# EAGLE design Haar_HardMount (EAGLE 9.6.2)
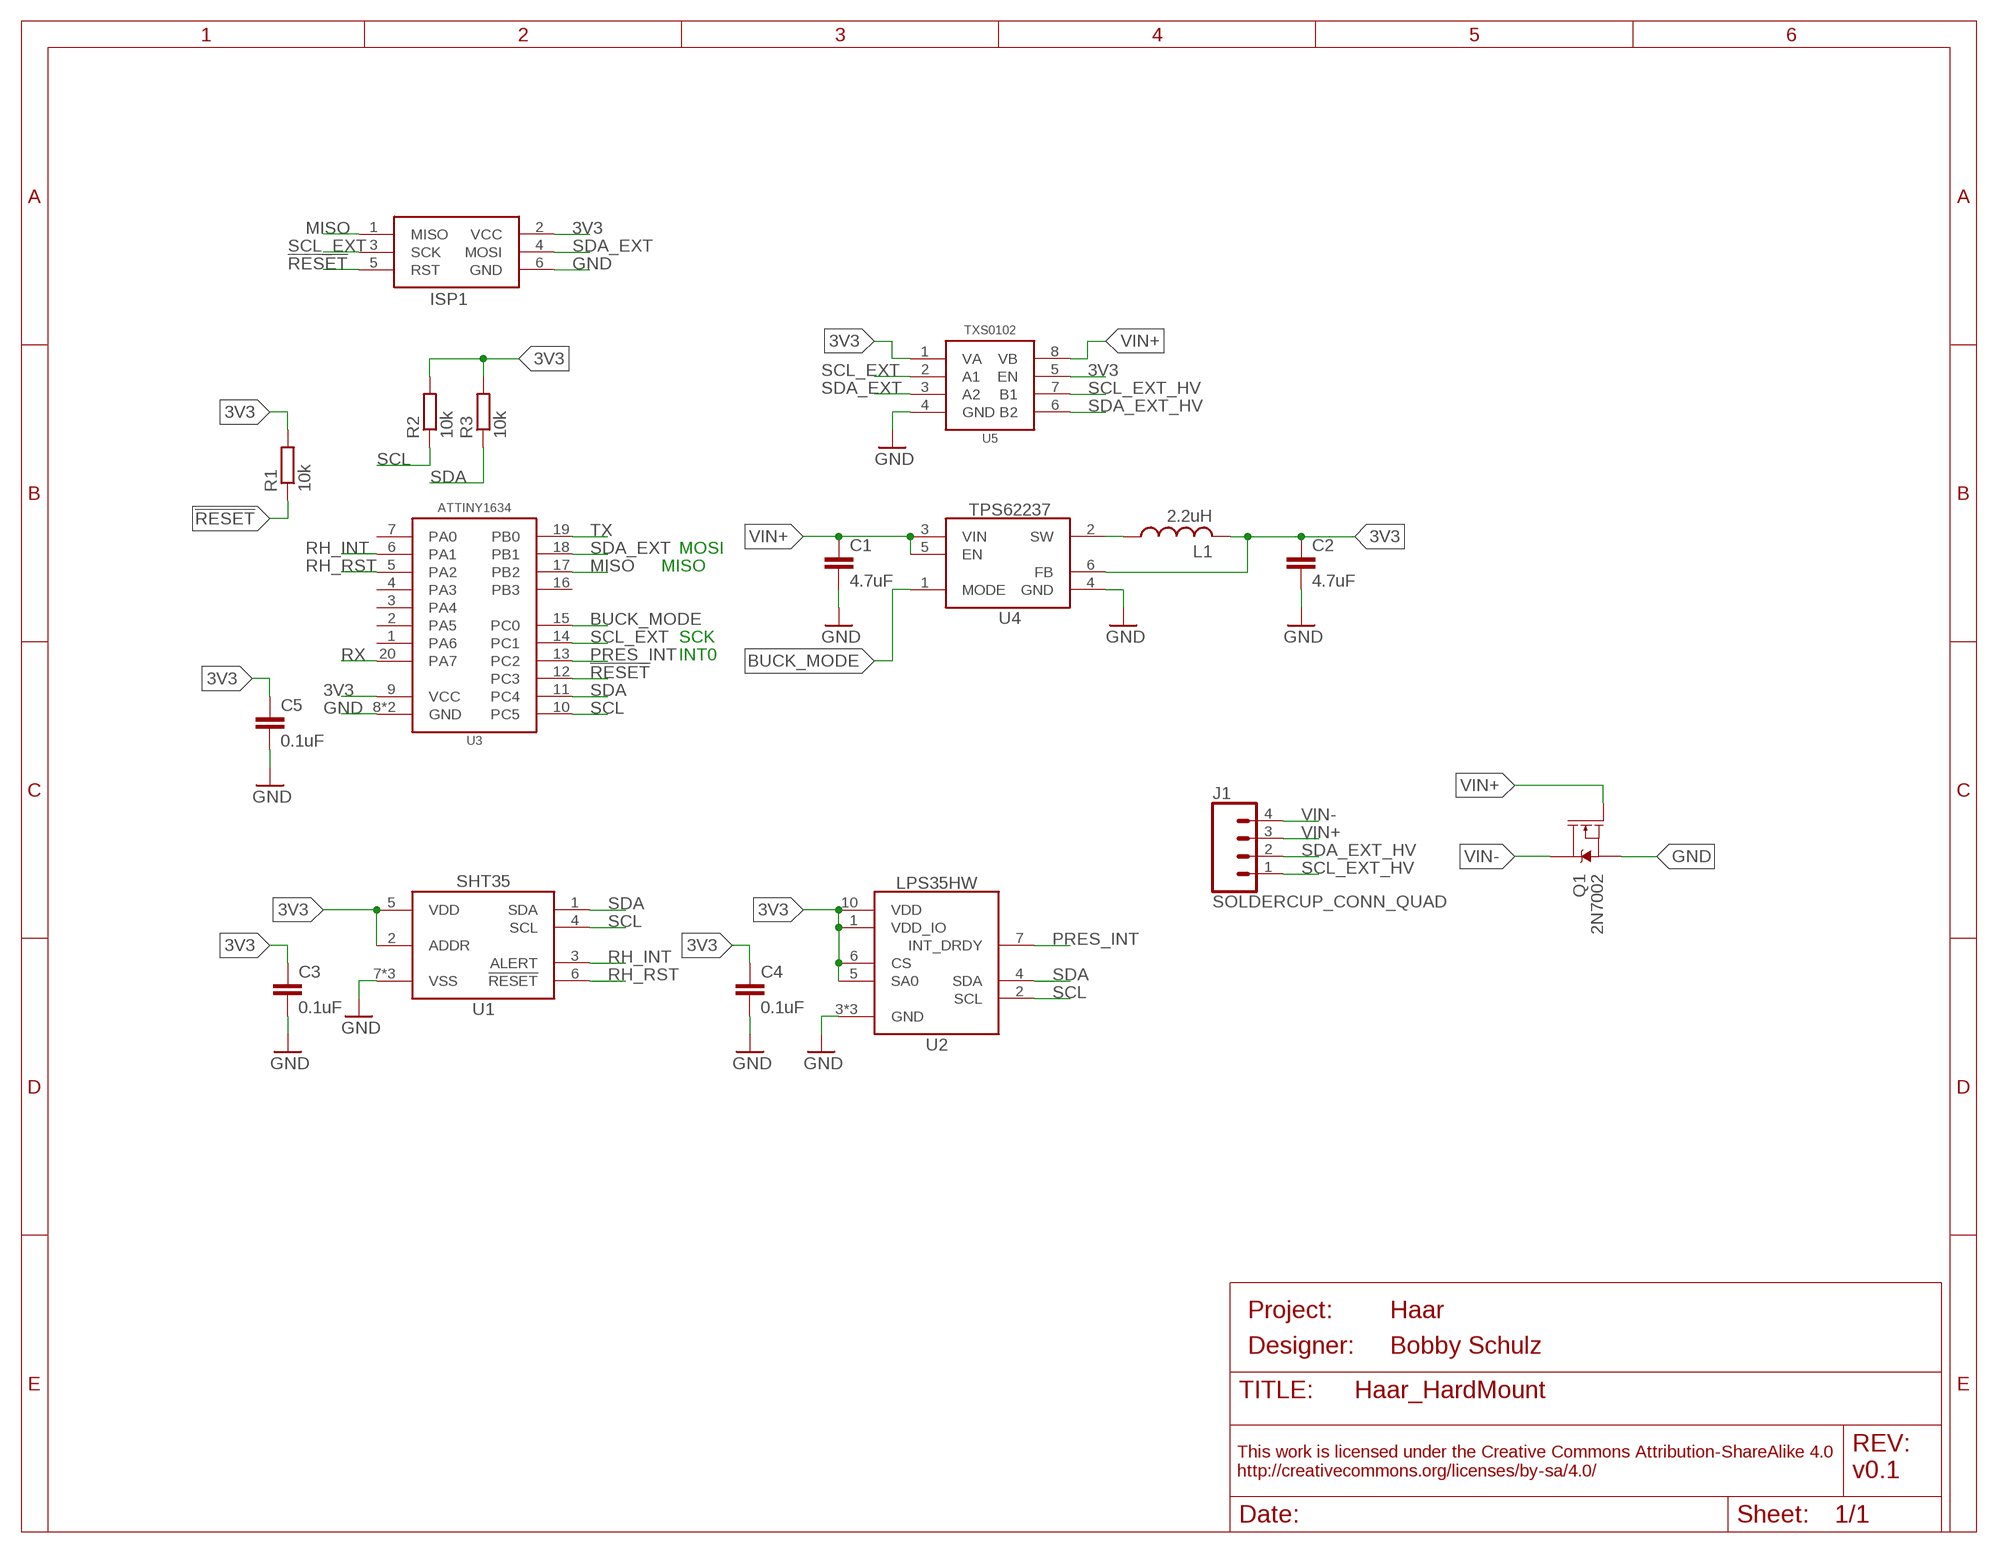
[diagram p0: schematic, sheet 1]
FRAME1 (FRAME_A_L): DESIGNER: Bobby Schulz; PROJECT: Haar; REV: v0.1

## Parts
C1  4.7uF  C-EUC0402  [C0402]
C2  4.7uF  C-EUC0402  [C0402]
C3  0.1uF  C-EU0.1UFC0402  [C0402]
C4  0.1uF  C-EU0.1UFC0402  [C0402]
C5  0.1uF  C-EU0.1UFC0402  [C0402]
ISP1  AVRISP1.27MM  [2X3_1.27]
J1  SOLDERCUP_CONN_QUAD  [SOLDERCUP_CONN_QUAD]
L1  2.2uH  INDUCTOR0805  [0805]
Q1  2N7002  MOSFET-NCH-2N7002PW  [SOT323]
R1  10k  R-EU_10KR0402  [R0402]
R2  10k  R-EU_10KR0402  [R0402]
R3  10k  R-EU_10KR0402  [R0402]
U1  SHT35DFN  [DFN_8_2.5X2.5]
U2  LPS35HW  [CCLGA10L]
U3  ATTINY1634QFN  [QFN20]
U4  TPS62237DRY  [DRY0006A]
U5  TXS0102DQM  [DQM_R-PX2SON-N8]

## Nets
3V3: C2.1 C3.1 C4.1 C5.1 ISP1.2(VCC) L1.2 R1.2 R2.2 R3.2 U1.2(ADDR) U1.5(VDD) U2.1(VDD_IO) U2.5(SA0) U2.6(CS) U2.10(VDD) U3.9(VCC) U4.6(FB) U5.1(VA) U5.5(EN)
!RESET: ISP1.5(RST) R1.1 U3.12(PC3)
BUCK_MODE: U3.15(PC0) U4.1(MODE)
GND: C1.2 C2.2 C3.2 C4.2 C5.2 ISP1.6(GND) Q1.2(S) U1.7(VSS) U1.8(VSS) U1.EP(VSS) U2.3(GND) U2.8(GND) U2.9(GND) U3.8(GND) U3.EP(GND) U4.4(GND) U5.4(GND)
MISO: ISP1.1(MISO) U3.17(PB2)
N$1: L1.1 U4.2(SW)
PRES_INT: U2.7(INT_DRDY) U3.13(PC2)
RH_INT: U1.3(ALERT) U3.6(PA1)
RH_RST: U1.6(!RESET) U3.5(PA2)
RX: U3.20(PA7)
SCL: R2.1 U1.4(SCL) U2.2(SCL) U3.10(PC5)
SCL_EXT: ISP1.3(SCK) U3.14(PC1) U5.2(A1)
SCL_EXT_HV: J1.1 U5.7(B1)
SDA: R3.1 U1.1(SDA) U2.4(SDA) U3.11(PC4)
SDA_EXT: ISP1.4(MOSI) U3.18(PB1) U5.3(A2)
SDA_EXT_HV: J1.2 U5.6(B2)
TX: U3.19(PB0)
VIN+: C1.1 J1.3 Q1.1(G) U4.3(VIN) U4.5(EN) U5.8(VB)
VIN-: J1.4 Q1.3(D)
Unconnected: U3.1(PA6) U3.2(PA5) U3.3(PA4) U3.4(PA3) U3.7(PA0) U3.16(PB3)

## Notes on the sheet
- MOSI
- MISO
- SCK
- INT0

## Library data of the parts
C1 C2 = bschulz_passives:C-EU: CAPACITOR, European symbol; DIGIKEY: 490-14306-1-ND; MF: Murata; MPN: GRM155R61A475MEAAD
C3-C5 = bschulz_passives:C-EU: CAPACITOR, European symbol; DIGIKEY: 490-4759-1-ND; MF: Murata; MPN: GCM155R71C104KA55D
ISP1 = bschulz:AVRISP: AVR ISP HEADER Standard 6 pin header for AVR programming
J1 = bschulz:SOLDERCUP_CONN_QUAD
L1 = bschulz:INDUCTOR: Genaric inductor; DIGIKEY: 732-2953-1-ND; MF: Wurth; MPN: 74479775222
Q1 = bschulz:MOSFET-NCH: N-channel MOSFETs Voltage controlled devices that allow control of high current outputs. SparkFun Products: SparkFun OpenScale <https://www.sparkfun.com/products/13261> SparkFun Digital Sandbox <https://www.sparkfun.com/products/12651> SparkFun Monster Moto Shield <https://www.sparkfun.com/products/10182> SparkFun MOSFET Power Controller <https://www.sparkfun.com/products/11214>; DIGIKEY: 2N7002W-FDICT-ND; MF: Diodes Incorporated; MPN: 2N7002W-7-F; PROD_ID: TRANS-11151
R1-R3 = bschulz_passives:R-EU_: RESISTOR, European symbol Digikey Parts: Yageo, 0402 <https://www.digikey.com/products/en/resistors/chip-resistor-surface-mount/52?k=&pkeyword=&sf=0&FV=ffec1104%2Cfffc000d%2C1c0002%2C440067%2C1f140000%2Cffe00034%2C400004&quantity=&ColumnSort=0&page=1&stock=1&pageSize=25> Yageo, 0603 <https://www.digikey.com/products/en/resistors/chip-resistor-surface-mount/52?k=&pkeyword=&s=4356&s=47360&sf=0&FV=fffc000d%2C1c0002%2C142c040c%2C1f140000%2Cffe00034&quantity=10&ColumnSort=1000011&page=1&stock=1&pageSize=25> Panasonic, 0603 <https://www.digikey.com/products/en/resistors/chip-resistor-surface-mount/52?k=&pkeyword=&pv252=68&sf=0&FV=ffec373d%2C1c0002%2C142c040c%2C1f140000%2Cffe00034%2C80002%2Cc0001&quantity=&ColumnSort=0&page=1&stock=1&pageSize=25> Panasonic, precision, 0603 <https://www.digikey.com/products/en/resistors/chip-resistor-surface-mount/52?FV=ffec4907%2Cfffc000a%2Cc0172%2C142c040c%2C1f140000%2Cffe00034%2C1c0002&quantity=100&ColumnSort=2085&page=1&stock=1&pageSize=25> Panasonic, 0805 <https://www.digikey.com/products/en/resistors/chip-resistor-surface-mount/52?k=&pkeyword=&pv3=1&sf=0&FV=ffec373d%2C1c0002%2C1f140000%2Cffe00034%2C142c040d&quantity=&ColumnSort=0&page=1&stock=1&pageSize=25> Rohm, current sense <https://www.digikey.com/products/en/resistors/chip-resistor-surface-mount/52?k=&pkeyword=&pv3=1&sf=0&FV=ffecb688%2C1f140000%2Cffe00034%2C1c0002&quantity=&ColumnSort=0&page=1&stock=1&pageSize=25> Vishay, pulse proof automotive <https://www.digikey.com/products/en/resistors/chip-resistor-surface-mount/52?k=&pkeyword=&pv7=2&sf=0&FV=ffec5d6b%2Cffe00034%2C1f140000&quantity=&ColumnSort=0&page=1&stock=1&pageSize=25>; DIGIKEY: 311-10.0KHRCT-ND; MF: Yageo; MPN: RC0603FR-0710KL; VALUE_PART: 10k
U1 = bschulz:SHT3*: SHT3x - Digital Humidity and Temperature Sensor Characteristics (for SHT35): Vcc: 2.15V ~ 5.5V Humidity Resolution: 0.01% RH Humidity Accuracy: ±1.5% RH Temperature Resolution: 0.01°C Temperature Accuracy: 0.1°C Operating Temperature: -40°C to 125°C Digikey: 1649-1065-1-ND (SHT30) <https://www.digikey.com/product-detail/en/sensirion-ag/SHT30-DIS-F2.5KS/1649-1065-1-ND/6212136> 1649-1066-1-ND (SHT31) <https://www.digikey.com/product-detail/en/sensirion-ag/SHT31-DIS-F2.5KS/1649-1066-1-ND/6212137> 1649-1067-1-ND (SHT35) <https://www.digikey.com/product-detail/en/sensirion-ag/SHT35-DIS-F2.5KS/1649-1067-1-ND/6212138>; DIGIKEY: 1649-1067-1-ND; DISP: SHT35; MF: Sensirion; MPN: SHT35-DIS-F2.5KS
U2 = bschulz:LPS3*HW: LPS3xHW - Digital Water Resistant Pressure Sensor Characteristics: Vcc: 1.7V ~ 3.6V Pressure Range: 260 ~ 1260 mBar Pressure Resolution: 0.24 μBar Pressure Accuracy: relative ±0.1 mBar, abs ± 1 mBar Temperature Resolution: 0.01°C Temperature Accuracy: 1.5°C Operating Temperature: -40°C to 125°C Digikey: 497-16706-1-ND (LPS35HW) <https://www.digikey.com/product-detail/en/stmicroelectronics/LPS35HWTR/497-16706-1-ND/6192808> 497-17590-1-ND (LPS33HW) <https://www.digikey.com/product-detail/en/stmicroelectronics/LPS33HWTR/497-17590-1-ND/7565514>; DIGIKEY: 497-16706-1-ND; DISP: LPS35HW; MF: ST; MPN: LPS35HWTR
U3 = bschulz:ATTINY1634: ATtiny1634 8 bit AVR Microcontroller Features: Vcc: 1.8 ~ 5.5V Clock: Up to 16MHz, Internal 8MHz FRC, 32kHz RC Flash Memory: 16K SRAM: 1K EEPROM: 256B ADC: 10b, 12 port USART: Yes, x2 SPI: Yes I2C: Yes, slave only Notes: 2 analog comp. Digikey: ATTINY1634R-MURCT-ND (QFN) <https://www.digikey.com/product-detail/en/microchip-technology/ATTINY1634R-MUR/ATTINY1634R-MURCT-ND/3440781> ATTINY1634R-SU-ND (SOIC) <https://www.digikey.com/product-detail/en/ATTINY1634R-SU/ATTINY1634R-SU-ND/3128699/?itemSeq=272981030>; DIGIKEY: ATTINY1634-MURCT-ND; MF: Atmel; MPN: ATTINY1634-MUR
U4 = bschulz:TPS6223*: TPS6223xx - Ultra Small Step Down Converter (Buck) Characteristics: Vin: 2.05V ~ 6V Vout: 1V ~ 3.3V (fixed increments) IQ: 22μA Output Current: 500 mA Operating Temperature: -40°C to 85°C Digikey: TPS62237 (3.3V Fixed) <https://www.digikey.com/product-detail/en/texas-instruments/TPS62237DRYR/296-39454-1-ND/5143402>; DIGIKEY: 296-39454-1-ND; DISP: TPS62237; MF: TI; MPN: TPS62237DRYR
U5 = bschulz:TXS0102: TXS0102 - 2 Channel Bidirectional Voltage Level Translator Characteristics: Vcc: 1.65 ~ 3.6V (Port A), 2.3 ~ 5.5V (Port B) IQ: 14.4μA Output Current: 50mA Output Type: Open Drain/Push-Pull Operating Temperature: -40°C to 85°C Digikey: 296-28368-1-ND (DQE) <https://www.digikey.com/product-detail/en/texas-instruments/TXS0102DQER/296-28368-1-ND/2625893> 296-28435-1-ND (DQM) <https://www.digikey.com/product-detail/en/texas-instruments/TXS0102DQMR/296-28435-1-ND/2638910> 296-21931-1-ND (DCU) <https://www.digikey.com/product-detail/en/texas-instruments/TXS0102DCUR/296-21931-1-ND/1629284>; DIGIKEY: 296-28435-1-ND; MF: TI; MPN: TXS0102DQMR

## Board
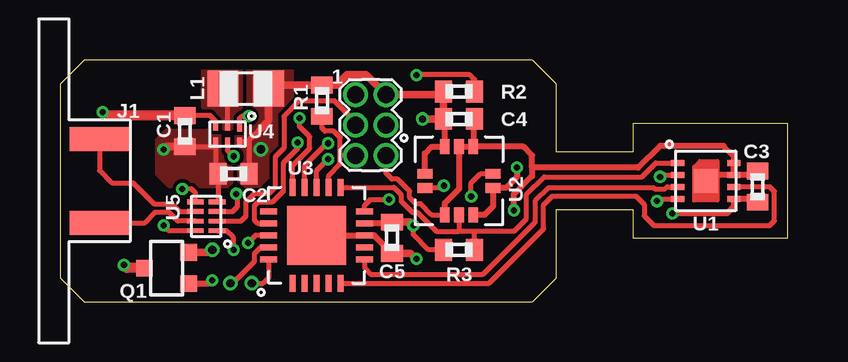
[diagram p1: board, top side]
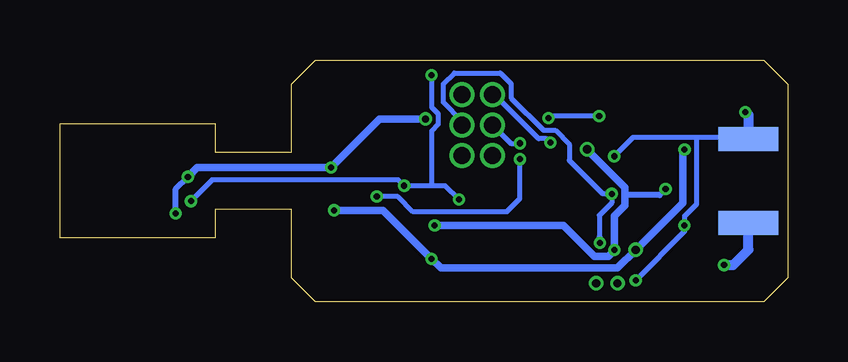
[diagram p2: board, bottom side, seen from below]

Size 30.35 x 10.08 mm. Coordinates in mm from the lower left corner, seen from the top.
Outline: 20.7,6.23 20.7,9.08 19.7,10.08 1,10.08 0,9.08 0,1 1,0 19.7,0 20.7,1 20.7,3.85 23.88,3.85 23.88,2.66 30.35,2.66 30.35,7.42 23.88,7.42 23.88,6.23 20.7,6.23
Copper layers (1*16): Top 0.035559375mm / dielectric 1.6mm / Bottom 0.035559375mm
Design rules "oshpark-2layer": minimum track width 6mil, minimum drill 10mil, track to track 6mil, track to pad 6mil, pad to pad 6mil, via to via 6mil, smd to smd 6mil, copper to edge 15mil, drill to drill 6mil, minimum pad ring 5mil, minimum via ring 5mil, stop-mask expansion 2.5mil, vias tented up to drill 0mil, thermal gap 10mil

### Footprints (pad centres in the part's own frame; a part is rotated, then mirrored left to right if it is on the bottom)
C0402 = smd 0.7 x 0.9: 1 -0.65,0; 2 0.65,0
2X3_1.27 = drill 0.7 pad 1.05: 1 -1.27,-0.635; 2 -1.27,0.635; 3 0,-0.635; 4 0,0.635; 5 1.27,-0.635; 6 1.27,0.635
SOLDERCUP_CONN_QUAD = smd 1 x 2.5: 1 1.75,1.27; 2 -1.75,1.27 | smd 1 x 2.5 bottom: 3 -1.75,1.27; 4 1.75,1.27
0805 = smd 1.3 x 1.5: 1 -0.95,0; 2 0.95,0
SOT323 = smd 0.7 x 0.7: 1 -0.65,-0.925; 2 0.65,-0.925; 3 0,0.925
R0402 = smd 0.7 x 0.9: 1 -0.65,0; 2 0.65,0
DFN_8_2.5X2.5 = smd 0.55 x 0.25: 1 -1.175,0.75; 2 -1.175,0.25; 3 -1.175,-0.25; 4 -1.175,-0.75; 5 1.175,-0.75; 6 1.175,-0.25; 7 1.175,0.25; 8 1.175,0.75 | smd 1 x 1: EP 0,0
CCLGA10L = smd 0.63 x 0.4: 1 -1.42,0.3; 2 -1.42,-0.3; 6 1.42,-0.3; 7 1.42,0.3 | smd 0.4 x 0.63: 3 -0.6,-1.42; 4 0,-1.42; 5 0.6,-1.42; 8 0.6,1.42; 9 0,1.42; 10 -0.6,1.42
QFN20 = smd 0.7 x 0.25: 1 -2.032,0.968; 2 -2.032,0.468; 3 -2.032,-0.032; 4 -2.032,-0.532; 5 -2.032,-1.032; 11 1.968,-1.032; 12 1.968,-0.532; 13 1.968,-0.032; 14 1.968,0.468; 15 1.968,0.968 | smd 0.25 x 0.7: 6 -1.032,-2.032; 7 -0.532,-2.032; 8 -0.032,-2.032; 9 0.468,-2.032; 10 0.968,-2.032; 16 0.968,1.968; 17 0.468,1.968; 18 -0.032,1.968; 19 -0.532,1.968; 20 -1.032,1.968 | smd 2.45 x 2.45: EP -0.032,-0.032
DRY0006A = smd 0.35 x 0.2: 1 -0.275,0.5 | smd 0.3 x 0.2: 2 -0.3,0; 3 -0.3,-0.5; 4 0.3,-0.5; 5 0.3,0; 6 0.3,0.5
DQM_R-PX2SON-N8 = smd 0.2 x 0.7: 1 -0.6,-0.45; 2 -0.2,-0.45; 3 0.2,-0.45; 4 0.6,-0.45; 5 0.6,0.45; 6 0.2,0.45; 7 -0.2,0.45; 8 -0.6,0.45

### Placement (x,y rotation side)
C1  5.21,7.11 270 top
C2  7.24,5.33 180 top
C3  29.08,4.8 90 top
C4  16.64,7.62 0 top
C5  13.84,2.67 270 top
ISP1  12.95,7.37 270 top
J1  0.38,5.04 270 top
L1  7.75,8.89 0 top
Q1  4.45,1.4 90 top
R1  10.92,8.38 90 top
R2  16.64,8.76 180 top
R3  16.64,2.16 180 top
U1  26.92,5.04 0 top
U2  16.64,5.04 0 top
U3  10.67,2.79 90 top
U4  6.99,6.99 270 top
U5  6.1,3.56 90 top

### Tracks (layer width: path | path; a pad name or v marks a point on that pad's centre or on a via)
3V3  (via drill 0.25, 0.3, 0.35)
  Top 0.2: U5.5 5.65,4.54 5.48,4.7 v5.1,4.7 | 6.76,2.96 U5.1 6.95,2.96 7.24,2.67 v7.24,2.16 | 8.38,7.24 7.89,6.75 7.89,6.68 | 7.89,6.68 C2.1 | U4.6 7.89,6.68 | v25.02,5.21 25.1,5.29 U1.2 | R3.2 15.37,2.16 14.73,2.79 v14.73,3.17
  Top 0.254: U2.1 15.22,6.19 15.49,6.46 U2.10 16.04,7.57 C4.1 | 28.93,4.25 C3.1 28.94,4.29 U1.5 28.1,3.97 27.81,3.68 v25.53,3.68 | v19.05,5.59 19.05,5.21 18.59,4.74 U2.6 18.06,3.97 17.71,3.62 U2.5 | C5.1 13.79,3.26 U3.9
  Top 0.305: 8.38,7.24 8.7,7.55 L1.2 8.84,9.03 R1.2 11.54,9.03 11.97,9.47 12.76,9.47 ISP1.2 15.86,8.64 R2.2 C4.1 v15.11,7.62 | v14.73,3.17 14.59,3.32 C5.1
  Bottom 0.254: v25.53,3.68 25.53,4.7 v25.02,5.21 | v19.05,5.59 | v5.1,4.7 5.36,4.45 6.79,4.45
  Bottom 0.305: v19.05,5.59 24.64,5.59 v25.02,5.21 | v14.73,3.17 9.35,3.17 8.07,1.89 7.48,1.89 7.24,2.13 v7.24,2.16 7.24,3.56 6.79,4.01 6.79,4.45 6.79,4.76 v8.38,6.35 | v19.05,5.59 17.02,7.62 v15.11,7.62
  pour Top (rank 2, no thermals): 7.87,9.65 7.87,7.24 7.75,7.11 7.37,7.11 7.37,5.21 7.75,4.83 8.26,4.83 9.65,6.22 9.65,9.78 9.53,9.91 8.13,9.91
!RESET
  Top 0.2: ISP1.5 11.68,6.1 | 11.68,6.1 11.68,6.84 11.41,7.11 11.05,7.11 10.92,7.24 R1.1 | 11.68,6.1 11.68,6.09 11.68,5.73 11.2,5.25 U3.12
BUCK_MODE  (via drill 0.25)
  Top 0.2: U4.1 7.49,7.64 7.58,7.74 v7.87,7.74 | v9.98,7.65 9.98,7.31 10.41,6.88 10.41,6.39 9.7,5.68 U3.15
  Bottom 0.2: v7.87,7.74 9.9,7.74 v9.98,7.65
GND  (via drill 0.25, 0.35)
  Top 0.2: ISP1.6 13.59,5.37 13.84,5.11 14.07,5.11 14.58,4.61 14.58,4.34 14.84,4.07 15.05,4.07 15.5,3.62 U2.3 | U4.4 6.49,6.48 | 6.49,6.48 6.49,5.44 C2.2 6.59,4.2 U5.4 | C1.2 6.47,6.46 6.49,6.48
  Top 0.254: U2.8 U2.9 16.64,4.7 16.04,4.1 U2.3 | C4.2 17.24,7.57 U2.8 | U1.7 U1.8 28.1,6.06 27.66,6.5 25.01,6.5 24.1,5.59 19.68,5.59 | 28.94,5.25 C3.2 28.98,5.29 U1.7 | C5.2 13.1,2.76 U3.8 U3.EP | v18.92,3.81 v18.93,3.81 18.93,4.47 19.68,5.24 19.68,5.59 | 19.68,5.59 19.68,6.1 19.32,6.46 U2.8 | 27.17,5.25 U1.EP 27.17,5.29 U1.7
  Top 0.305: v4.32,6.35 4.43,6.46 C1.2 | v14.86,1.78 14.62,2.02 C5.2 | v6.35,2.16 6.24,2.05 Q1.2
  Bottom 0.305: v4.32,6.35 4.39,6.27 4.39,4.12 v6.35,2.16 7.11,1.4 14.48,1.4 v14.86,1.78 16.89,3.81 v18.92,3.81
  pour Top (no thermals): 4.45,7.11 6.6,7.11 6.73,6.99 6.73,6.22 7.11,5.84 7.11,4.95 6.99,4.83 4.57,4.83 4.06,5.33 4.06,6.73
MISO  (via drill 0.25)
  Top 0.2: v9.91,6.64 9.91,6.39 9.32,5.8 9.32,4.62 8.84,4.14 8.24,4.14 8.1,3.99 8.1,3.4 8.24,3.26 U3.17
  Bottom 0.2: ISP1.1 12.24,8.64 10.39,6.79 10.06,6.79 v9.91,6.64
N$1
  Top 0.2: U4.2 6.99,8.7 L1.1
  pour Top (rank 3, no thermals): 6.73,7.37 6.86,7.24 7.11,7.24 7.24,7.37 7.24,7.75 7.62,8.13 7.62,9.65 7.49,9.78 6.1,9.78 5.97,9.65 5.97,8.13 6.22,7.87 6.6,7.87 6.73,7.75
PRES_INT  (via drill 0.25)
  Top 0.2: v17.14,4.38 17.14,4.95 17.53,5.34 U2.7 | U3.13 10.7,5.47 v11.18,5.94
  Bottom 0.2: v17.14,4.38 16.27,4.38 15.63,3.75 11.73,3.75 11.18,4.3 v11.18,5.94
RH_INT
  Top 0.2: U3.6 12.7,1.4 12.95,1.14 17.64,1.14 19.81,3.31 19.81,4.19 20.37,4.75 24.76,4.75 24.81,4.7 25.23,4.7 25.32,4.79 U1.3
RH_RST
  Top 0.2: U3.5 17.89,0.76 20.16,3.04 20.16,4.04 20.53,4.4 24.01,4.4 24.36,4.05 24.36,3.58 24.77,3.17 29.59,3.17 29.79,3.37 29.79,4.6 29.59,4.79 U1.6
RX  (via drill 0.35)
  Top 0.2: U3.20 8.7,1 8.46,0.76 v8,0.76
SCL  (via drill 0.25)
  Top 0.2: U3.10 12.7,4.02 12.94,4.26 v13.72,4.26 | v24.89,4.19 24.99,4.29 U1.4 | v16,4.83 15.91,4.74 U2.2 | v14.86,9.45 14.88,9.46 17.09,9.46 17.29,9.27 R2.1
  Bottom 0.2: v13.72,4.26 14.29,4.83 14.86,4.83 | 14.86,4.83 v16,4.83 16.26,5.09 24,5.09 v24.89,4.19 | v14.86,9.45 14.86,8.12 14.58,7.84 14.58,7.4 14.86,7.12 14.86,4.83
SCL_EXT  (via drill 0.25)
  Top 0.2: ISP1.3 12.32,7.49 11.43,8.38 10,8.38 9.34,7.72 9.34,6.4 8.97,6.04 8.97,4.77 8.69,4.49 8.1,4.49 7.75,4.14 7.75,3.56 7.54,3.36 U5.2 | U3.14 10.2,5.68 11.12,6.6 v11.18,6.6
  Bottom 0.2: ISP1.3 11.56,6.6 v11.18,6.6
SCL_EXT_HV
  Top 0.2: U5.7 4.91,3.36 4.54,3.73 3.98,3.73 3.55,3.29 J1.1
SDA
  Top 0.2: U2.4 16.64,2.93 | 17.29,2.93 18.93,2.93 19.43,3.43 19.43,4.45 20.19,5.21 24.26,5.21 24.84,5.79 U1.1 | 17.29,2.93 16.64,2.93 | U3.11 13.93,4.76 14.22,4.46 14.22,4.32 14.22,4.19 14.69,3.72 14.9,3.72 15.69,2.93 16.64,2.93 | R3.1 17.29,2.93
SDA_EXT  (via drill 0.25)
  Top 0.2: U3.18 8.15,2.76 v7.84,2.45 | 6.61,3.76 U5.3 7.2,3.76 7.39,3.95 7.39,4.46 v7.35,4.5
  Bottom 0.2: ISP1.4 13.59,7.54 14.37,8.31 14.37,9.09 13.91,9.54 12,9.54 11.54,9.09 11.54,8.5 10.19,7.15 9.7,7.15 9.11,6.56 9.11,5.89 7.73,4.5 v7.35,4.5 7.35,4.12 7.87,3.6 7.87,2.71 7.84,2.68 v7.84,2.45
SDA_EXT_HV
  Top 0.2: 5.43,3.76 U5.6 5.01,3.76 4.68,4.08 3.92,4.08 3.05,4.95 2.16,4.95 1.65,5.46 J1.2
TX  (via drill 0.35)
  Top 0.2: U3.19 8.37,2.27 8.1,1.99 8.1,1.66 7.2,0.76 v7.11,0.76
VIN+  (via drill 0.25)
  Top 0.2: U5.8 4.54,2.96 v4.32,3.17 | U4.3 6.49,7.54 6.26,7.76 C1.1 | U4.5 6.99,6.3 7.23,6.06 v7.25,6.06
  Top 0.254: v6.35,0.89 6.21,0.75 Q1.1
  Top 0.406: C1.1 1.93,7.76 v1.78,7.91
  Bottom 0.2: v6.35,0.89 4.32,2.92 v4.32,3.17 4.32,3.56 3.81,4.07 3.81,6.86 | v7.25,6.06 6.45,6.86 3.81,6.86 | J1.3 1.76,6.86 3.81,6.86
  Bottom 0.406: v1.78,7.91 1.65,7.78 J1.3
VIN-  (via drill 0.25)
  Top 0.406: Q1.3 2.79,1.4 v2.67,1.52
  Bottom 0.406: v2.67,1.52 2.29,1.52 1.65,2.16 J1.4

### Text on the board
tDocu: SDA | SCL
bDocu: Vin+ | Project Haar v0.1 / ---------------- / Developed by / Northern Widget and / University of Minnesota | Vin-